# EAGLE schematic LaunchpadRJ11Baseboard_Mk2 (EAGLE 6.1)
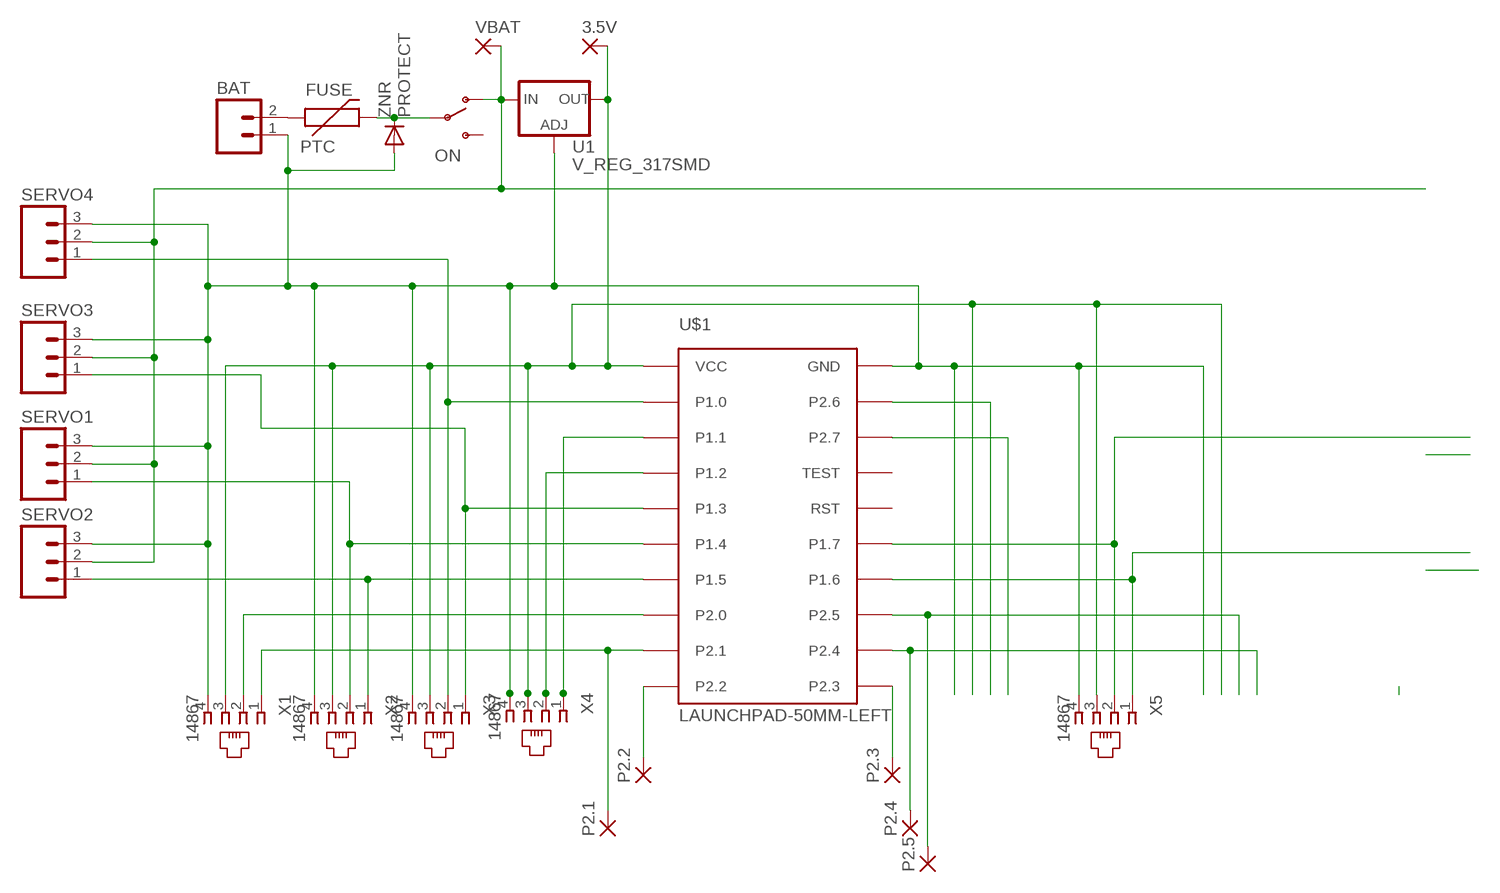
[diagram p0: schematic, sheet 1]

## Parts
3.5V  2,15/1,0  [2,15/1,0]
BAT  M02PTH  [1X02]
FUSE  PTC  PTCPTH  [PTC]
ON  SWITCH-SPSTPTH  [SWITCH-SPDT]
P2.1  2,15/1,0  [2,15/1,0]
P2.2  2,15/1,0  [2,15/1,0]
P2.3  2,15/1,0  [2,15/1,0]
P2.4  2,15/1,0  [2,15/1,0]
P2.5  2,15/1,0  [2,15/1,0]
SERVO1  M03PTH  [1X03]
SERVO2  M03PTH  [1X03]
SERVO3  M03PTH  [1X03]
SERVO4  M03PTH  [1X03]
U1  V_REG_317SMD  [SOT223]
U$1  LAUNCHPAD-50MM-LEFT  [LAUNCHPAD-50MM-LEFT]
VBAT  2,15/1,0  [2,15/1,0]
X1  14867  [14867]
X2  14867  [14867]
X3  14867  [14867]
X4  14867  [14867]
X5  14867  [14867]
ZNR  PROTECT  1N4004  [DO41-10]

## Nets
GND: BAT.1 SERVO1.3 SERVO2.3 SERVO3.3 SERVO4.3 U1.1(ADJ) U$1.GND X1.4 X2.4 X3.4 X4.4 X5.4 ZNR.A
N$1: U$1.P1.2 X4.2
N$2: BAT.2 FUSE.P$1
N$3: SERVO4.1 U$1.P1.0 X3.2
N$4: U$1.P1.1 X4.1
N$6: SERVO3.1 U$1.P1.3 X3.1
N$7: SERVO1.1 U$1.P1.4 X2.2
N$8: SERVO2.1 U$1.P1.5 X2.1
N$9: U$1.P2.6
N$10: U$1.P2.7
N$11: U$1.P1.7 X5.2
N$12: U$1.P1.6 X5.1
N$13: P2.5.1(P) U$1.P2.5
N$14: P2.4.1(P) U$1.P2.4
N$15: U$1.P2.0 X1.2
N$16: FUSE.P$2 ON.2(P) ZNR.C
N$17: P2.2.1(P) U$1.P2.2
N$19: P2.1.1(P) U$1.P2.1 X1.1
N$21: P2.3.1(P) U$1.P2.3
VBAT: ON.1(O) SERVO1.2 SERVO2.2 SERVO3.2 SERVO4.2 U1.3(IN) VBAT.1(P)
VCC: 3.5V.1(P) U1.2(OUT) U$1.VCC X1.3 X2.3 X3.3 X4.3 X5.3
Unconnected: ON.3(S) U$1.RST U$1.TEST

## Library data of the parts
3.5V P2.1-P2.5 VBAT = wirepad:2,15/1,0: THROUGH-HOLE PAD
BAT = SparkFun:M02: Header 2 Standard 2-pin 0.1" header. Use with straight break away headers (SKU : PRT-00116), right angle break away headers (PRT-00553), swiss pins (PRT-00743), machine pins (PRT-00117), and female headers (PRT-00115). Molex polarized connector foot print use with SKU : PRT-08233 with associated crimp pins and housings.
FUSE = SparkFun:PTC: Resettable Fuse PTC Resettable Fuse. Spark Fun Electronics SKU : COM-08357
ON = SparkFun:SWITCH-SPST: SPST Switch Simple slide switch. Spark Fun Electronics SKU : COM-00102
SERVO1-SERVO4 = SparkFun:M03: Header 3 Standard 3-pin 0.1" header. Use with straight break away headers (SKU : PRT-00116), right angle break away headers (PRT-00553), swiss pins (PRT-00743), machine pins (PRT-00117), and female headers (PRT-00115). Molex polarized connector foot print use with SKU : PRT-08232 with associated crimp pins and housings.
U1 = SparkFun:V_REG_317: Voltage Regulator Standard LM317 adjustable voltage regulator. AOI (Adjust Output Input). Google 'LM317 Calculator' for easy to use app to get the two resistor values needed. 240/720 for 5V output. 240/390 for 3.3V output. Spark Fun Electronics SKU : COM-00527
U$1 = TI_launchpad:LAUNCHPAD: MSP-EXP430G2 LaunchPad Booster Pack layouts. LAUNCHPAD: Full-size board LAUNCHPAD-50MM: 50x50mm board covering the button area LAUNCHPAD-50MM-LEFT: 50x50mm board leaving the button area open. Tall LaunchPad components marked on Reference for reference.
X1-X5 = con-4ucon:14867: RJ11 Connector Source: 4UCON TECHNOLOGY INC. 14867.pdf; OC_FARNELL: unknown; OC_NEWARK: unknown
ZNR = diode:1N4004: DIODE general purpose rectifier, 1 A